# Altium schematic sheet 13-GPRS.SchDoc
size A4
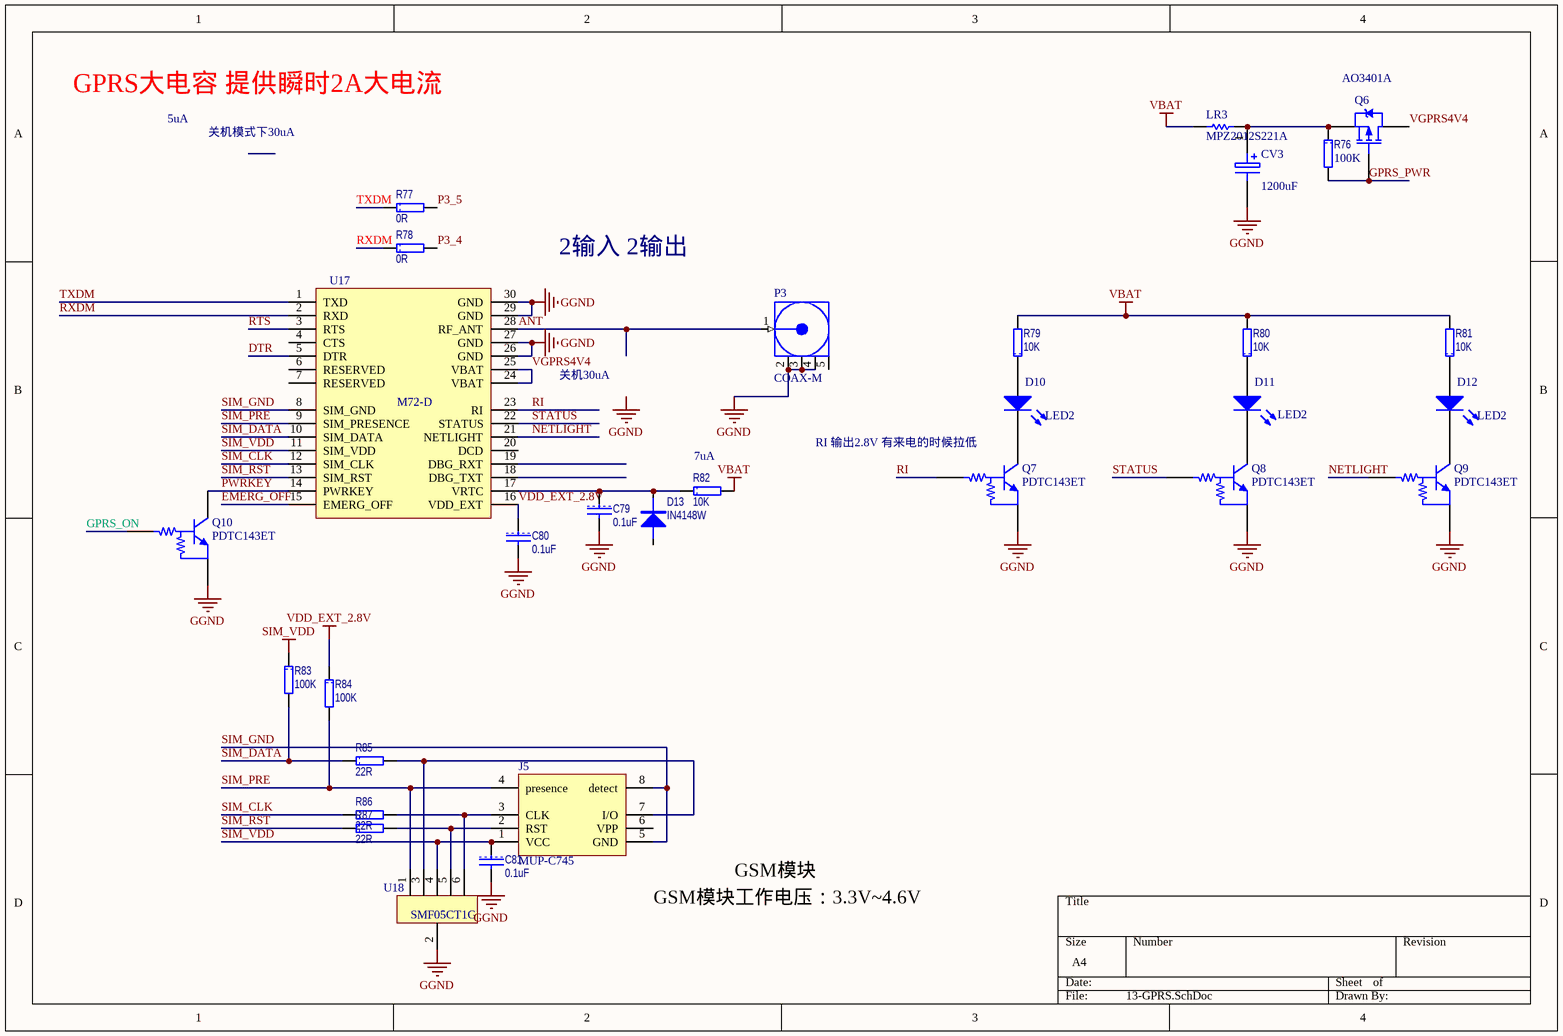
[diagram p0: 13-GPRS.SchDoc]

## Parts
C79  0.1uF  [1608[0603]]
C80  0.1uF  [1608[0603]]
C81  0.1uF  [1608[0603]]
CV3  value 1200uF  [CAPPR5-10x20/H1.1]  (hidden comment: EEUFC1A122)
D10  LED2  [0805LED]
D11  LED2  [0805LED]
D12  LED2  [0805LED]
D13  IN4148W  [SOD123]
J5  MUP-C745  [MUP-C745]
LR3  MPZ2012S221A  [2012[0805]]
P3  COAX-M  [MHF[MCB3]-V4]
Q6  AO3401A  [SOT23_N]
Q7  PDTC143ET  [SOT23_N]
Q8  PDTC143ET  [SOT23_N]
Q9  PDTC143ET  [SOT23_N]
Q10  PDTC143ET  [SOT23_N]
R76  value 100K  [1608[0603]R]  (hidden comment: CRCW0603100KFKEA)
R77  0R  [1608[0603]R]
R78  0R  [1608[0603]R]
R79  10K  [1608[0603]R]
R80  10K  [1608[0603]R]
R81  10K  [1608[0603]R]
R82  10K  [1608[0603]R]
R83  100K  [1608[0603]R]
R84  100K  [1608[0603]R]
R85  22R  [1608[0603]R]
R86  22R  [1608[0603]R]
R87  22R  [1608[0603]R]
U17  M72-D  [M72D]
U18  SMF05CT1G  [SOT23-6_N]

## Nets
GGND: C79.2 C80.2 C81.2 CV3.2 P3.2(GND) P3.3(GND) P3.4(GND) Q7.2(E) Q8.2(E) Q9.2(E) Q10.2(E) U17.26(GND) U17.27(GND) U17.29(GND) U17.30(GND) U18.2
SIM_VDD: C81.1 J5.1(VCC) R83.1 U17.11(SIM_VDD) U18.4
VBAT: LR3.1 R79.2 R80.2 R81.2 R82.2
VDD_EXT_2.8V: C80.1 R84.1 U17.16(VDD_EXT)
ANT: P3.1(Signal) U17.28(RF_ANT)
DTR: U17.5(DTR)
EMERG_OFF: U17.15(EMERG_OFF)
GPRS_ON: Q10.1(B)
GPRS_PWR: Q6.1(G) R76.2
NETLIGHT: Q9.1(B) U17.21(NETLIGHT)
P3_4: R78.2
P3_5: R77.2
PWRKEY: Q10.3(C) U17.14(PWRKEY)
RI: Q7.1(B) U17.23(RI)
RTS: U17.3(RTS)
RXDM: R78.1 U17.2(RXD)
SIM_CLK: R86.1 U17.12(SIM_CLK)
SIM_DATA: R83.2 R85.1 U17.10(SIM_DATA)
SIM_GND: J5.5(GND) J5.8(detect) U17.8(SIM_GND)
SIM_PRE: J5.4(presence) R84.2 U17.9(SIM_PRESENCE) U18.1
SIM_RST: R87.1 U17.13(SIM_RST)
STATUS: Q8.1(B) U17.22(STATUS)
TXDM: R77.1 U17.1(TXD)
VGPRS4V4: Q6.3(D) U17.24(VBAT) U17.25(VBAT)
NetC79_1: C79.1 D13.2 R82.1 U17.17(VRTC)
NetCV3_1: CV3.1 LR3.2 Q6.2(S) R76.1
NetD10_1: D10.1(A) R79.1
NetD10_2: D10.2(K) Q7.3(C)
NetD11_1: D11.1(A) R80.1
NetD11_2: D11.2(K) Q8.3(C)
NetD12_1: D12.1(A) R81.1
NetD12_2: D12.2(K) Q9.3(C)
NetJ5_2: J5.2(RST) R87.2 U18.5
NetJ5_3: J5.3(CLK) R86.2 U18.6
NetJ5_7: J5.7(I/O) R85.2 U18.3

Not connected (* = marked no-connect by the designer): D13 1; J5 6(VPP); P3 5(GND); U17 4(CTS) 6(RESERVED) 7(RESERVED) 18(DBG_TXT) 19(DBG_RXT) 20(DCD)

## Notes on the sheet
- GPRS大电容 提供瞬时2A大电流
- 5uA
- 关机模式下30uA
- 2输入 2输出
- 关机30uA
- (near Q7) RI 输出2.8V 有来电的时候拉低
- (near R82) 7uA
- (near J5) GSM模块工作电压：3.3V~4.6V
- GSM模块
- Labels drawn without touching a wire or pin: GGND

## Library data of the parts
C79-C81 = CAP: Capacitor; Manufacturer: TDK; Type: 无铅电容; Model: C0603X7R1H104K; Value: 0.1uF
CV3 = ELECTRO1: 插针 铝质电解电容器 - 带引线 1200uF 10V; Manufacturer: Panasonic Electronic Components; Manufacturer Part Number: EEU-FC1A122; 工作温度范围: - 55 C to + 105 C; 封装: Bulk; 产品: High Temp Electrolytic Capacitors; 系列: FC; 端接类型: Radial; 容差: 20 %; 外壳直径: 10 mm; 外壳长度: 20 mm; 引线间隔: 5 mm; 制造商: Panasonic; 产品种类: Radial Electrolytic Aluminum Capacitors; 标准包装数量: 200; Supplier 1: Mouser; Supplier Part Number 1: 667-EEU-FC1A122; RoHS: RoHS Compliant; Description 1: 铝质电解电容器 - 带引线 1200uF 10V; Category: 铝质电解电容器 - 带引线; Stock 1: 1597; Pricing 1: 1=0.330, 25=0.300, 100=0.275, 250=0.254, 500=0.250, 1000=0.241, 2000=0.230, 5000=0.214 (USD); 电容: 1200 uF; 电压额定值: 10 V; RoHS - 贸泽: Y; Minimum Order Quantity: 1; Reeling: False; ComponentLink1URL: http://www.mouser.com/ds/2/315/ABA0000CE22-7179.pdf; ComponentLink1Description: http://www.mouser.com/ds/2/315/ABA0000CE22-7179.pdf
D10-D12 = LED2: Typical RED, GREEN, YELLOW, AMBER GaAs LED; Published: 8-Jun-2000; LatestRevisionDate: 17-Jul-2002; LatestRevisionNote: Re-released for DXP Platform.; PackageVersion: Feb-2002; PackageReference: 3.2X1.6X1.1; Publisher: Altium Limited; PackageDescription: SM LED; 2 Flat Leads
D13 = DIODE
J5 = SIMCARD: CON; 公司: MUP
LR3 = Res Semi: 电磁干扰滤波珠子、扼流圈和阵列 Ferrite Chip Beads; Manufacturer: TDK; 阻抗: 220 Ohms; 最大直流电流: 3 A; 最大直流电阻: 0.04 Ohms; 工作温度范围: - 55 C to + 125 C; 封装 / 箱体: 2012; 封装: Reel; 端接类型: SMD/SMT; 容差: 25 %; 产品种类: Ferrite Beads; 标准包装数量: 4000; Supplier 1: Mouser; Supplier Part Number 1: 810-MPZ2012S221A; Manufacturer Part Number: MPZ2012S221A; RoHS: RoHS Compliant; Description 1: 电磁干扰滤波珠子、扼流圈和阵列 Ferrite Chip Beads; Category: 电磁干扰滤波珠子、扼流圈和阵列; Stock 1: 26540; Pricing 1: 1=0.070, 50=0.060, 100=0.053, 500=0.040, 1000=0.035, 4000=0.031, 8000=0.029, 12000=0.025 (USD); 制造商: TDK; RoHS - 贸泽: Y; Minimum Order Quantity: 1; Reeling: True; ComponentLink1URL: http://www.mouser.com/ds/2/400/e9413_mpz-24582.pdf; ComponentLink1Description: http://www.mouser.com/ds/2/400/e9413_mpz-24582.pdf
P3 = COAX-M: RF Coaxial PCB Connector, MMCX; Thru-Hole, Vertical Mount Plug,  50 Ohm Impedance; PackageDocument: Rev. A, 16-Jun-1997; PCB_Layout: Complies with manufacturer's recommendation.; DrillSize: Corresponds to nominal value.; Published: 15-Jul-2004; LatestRevisionDate: 15-Jul-2004; LatestRevisionNote: Component Replaced.; DatasheetDocument: 30-May-2003; PackageReference: 908-21103; Publisher: Altium Limited; ComponentLink1Description: Manufacturer Link; ComponentLink1URL: http://www.amphenolrf.com/
Q6 = IRLML5103: MOSFET P-CH -30V -4.3A SOT23; Manufacturer: Alpha & Omega Semiconductor Inc; FET Type: MOSFET P-Channel, Metal Oxide; FET Feature: Logic Level Gate, 2.5V Drive; Drain to Source Voltage (Vdss): 30V; Current - Continuous Drain (Id) @ 25° C: 4.3A (Ta); Rds On (Max) @ Id, Vgs: 44 mOhm @ 4.3A, 10V; Vgs(th) (Max) @ Id: 1.3V @ 250μA; Gate Charge (Qg) @ Vgs: 12.2nC @ 4.5V; Input Capacitance (Ciss) @ Vds: 1200pF @ 15V; Power - Max: 1.4W; Supplier 1: Digi-Key; Supplier Part Number 1: 785-1001-6-ND; Manufacturer Part Number: AO3401A; RoHS: RoHS Compliant; Description 1: MOSFET P-CH -30V -4.3A SOT23; Category: Discrete Semiconductor Products; Stock 1: 75922; Pricing 1: 1=0.48, 25=0.2792, 100=0.225, 250=0.162, 500=0.1305, 1000=0.10125 (USD); Packaging: Digi-Reel?; Mounting Type: Surface Mount; Package / Case: TO-236-3, SC-59, SOT-23-3; Supplier Device Package: SOT-23-3; ComponentLink1URL: http://www.aosmd.com/res/data_sheets/AO3401A.pdf; ComponentLink1Description: http://www.aosmd.com/res/data_sheets/AO3401A.pdf
Q7-Q10 = PDTC143ET: NPN Resistor-equipped Transistor; Published: 17-Sep-2003; LatestRevisionDate: 12-Dec-2006; LatestRevisionNote: IPC-7351 Footprint Added.; DatasheetVersion: 15-Apr-1999; PackageVersion: May-1999; PackageReference: SOT23; Publisher: Altium Limited; PackageDescription: 3-Pin SOT-23 Package 0.95 mm Pitch, 2.3 mm Lead Span; ComponentLink1Description: Manufacturer Link; ComponentLink1URL: http://www.semiconductors.philips.com/; ComponentLink2Description: Datasheet; ComponentLink2URL: http://www.semiconductors.philips.com/acrobat/datasheets/PDTC143E_SERIES_9.pdf
R76 = RES: 厚膜电阻器 - SMD 1/10watt 100Kohms 1%; Manufacturer: Vishay / Dale; 尺寸: 0.85 mm W x 1.55 mm L x 0.45 mm H; 工作温度范围: - 55 C to + 155 C; 封装 / 箱体: 0603 (1608 metric); 封装: Reel; 功率额定值: 100 mW; 产品: Thick Film Resistors SMD; 系列: CRCW; 温度系数: 100 PPM / K; 端接类型: SMD/SMT; 电压额定值: 75 V; 制造商: Vishay; 产品种类: 0603 Thick Film Chip Resistors; 标准包装数量: 5000; 外壳代码 - in: 0603; 外壳代码 - mm: 1608; Supplier 1: Mouser; Supplier Part Number 1: 71-CRCW0603-100K-E3; Manufacturer Part Number: CRCW0603100KFKEA; RoHS: RoHS Compliant By Exemption; Category: 厚膜电阻器 - SMD; Stock 1: 175756; Pricing 1: 1=0.080, 10=0.013, 100=0.010, 1000=0.008, 5000=0.005, 25000=0.004, 50000=0.003 (USD); 电阻: 100 kOhms; 容差: 1 %; RoHS - 贸泽: E; Minimum Order Quantity: 1; Reeling: True; ComponentLink1URL: http://www.mouser.com/ds/2/427/dcrcwe3-109170.pdf; ComponentLink1Description: http://www.mouser.com/ds/2/427/dcrcwe3-109170.pdf; Description 1: 厚膜电阻器 - SMD 1/10watt 100Kohms 1%
R77 R78 = RES: Model: RT0603DRD7D0RL; 公司: vishay; Parameters: 50V 1/10W 0.5%; Type: 无铅电阻; Value: 0R
R79-R82 = RES: Model: CRCW060310K0KKEDTR; 公司: vishay; Parameters: 50V 1/10W 0.5%; Type: 无铅电阻; Value: 10K
R83 R84 = RES: Model: CRCW0603100K0KKEDTR; 公司: vishay; Parameters: 50V 1/10W 0.5%; Type: 无铅电阻; Value: 100K
R85-R87 = RES: Model: CRCW060322R0KKEDTR; 公司: vishay; Parameters: 50V 1/10W 0.5%; Type: 无铅电阻; Value: 22R
U17 = M72-D: GSM模块; 公司: 上海移远
U18 = SMF05CT1G: ESD; 公司: ON